# EAGLE design TIA Schematic (EAGLE 6.6.0)
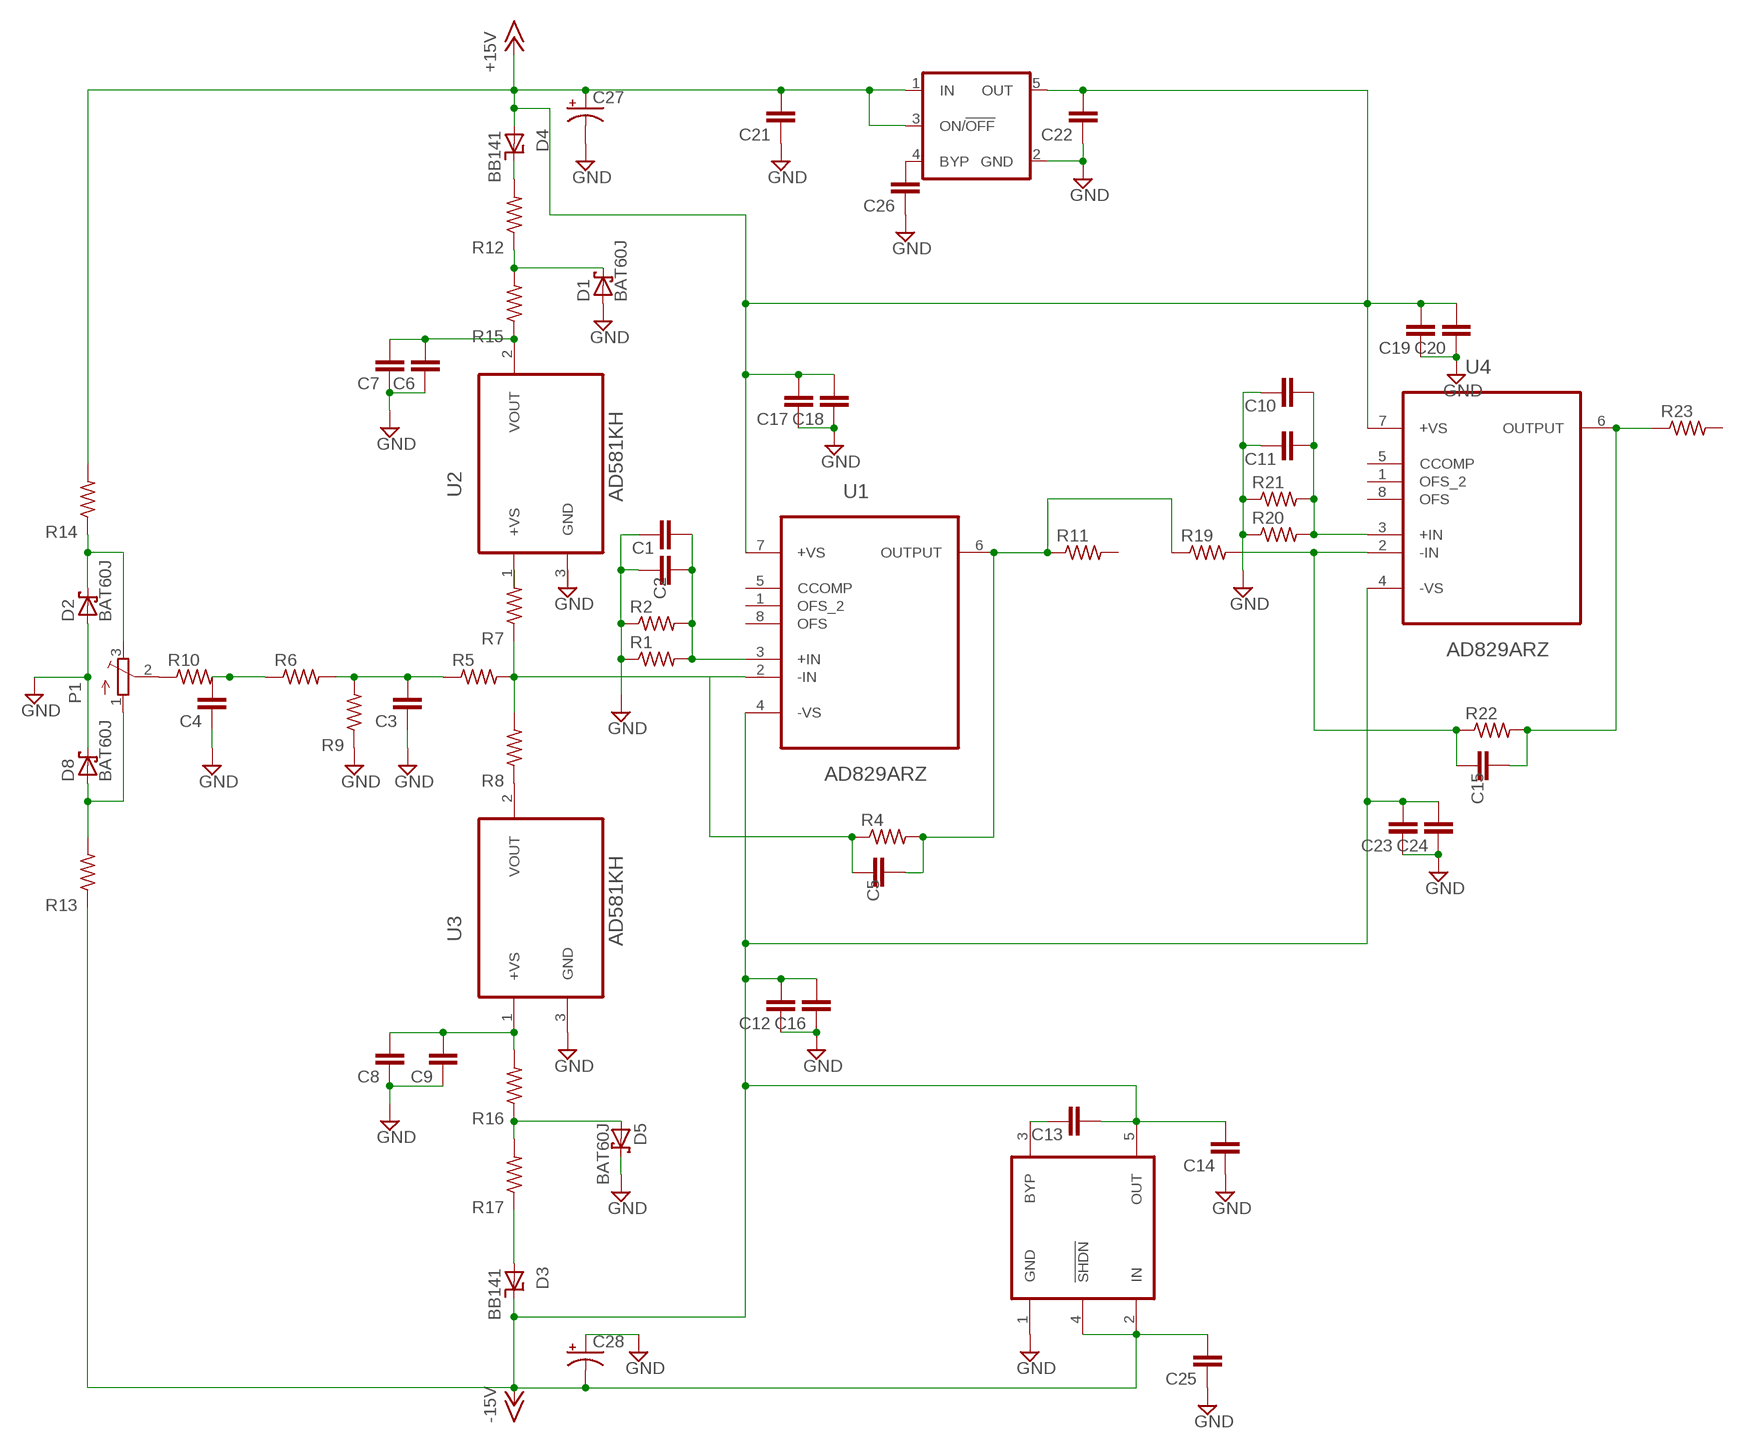
[diagram p0: schematic, sheet 1]

## Parts
C1  C-EUC0603  [C0603]
C2  C-EUC0603  [C0603]
C3  C-EUC0603  [C0603]
C4  C-EUC0603  [C0603]
C5  C-EUC0603  [C0603]
C6  C-EUC0603  [C0603]
C7  C-EUC0603  [C0603]
C8  C-EUC0603  [C0603]
C9  C-EUC0603  [C0603]
C10  C-EUC0603  [C0603]
C11  C-EUC0603  [C0603]
C12  C-EUC0603  [C0603]
C13  C-EUC0603  [C0603]
C14  C-EUC0603  [C0603]
C15  C-EUC0603  [C0603]
C16  C-EUC0603  [C0603]
C17  C-EUC0603  [C0603]
C18  C-EUC0603  [C0603]
C19  C-EUC0603  [C0603]
C20  C-EUC0603  [C0603]
C21  C-EUC0603  [C0603]
C22  C-EUC0603  [C0603]
C23  C-EUC0603  [C0603]
C24  C-EUC0603  [C0603]
C25  C-EUC0603  [C0603]
C26  C-EUC0603  [C0603]
C27  CPOL-USETR3  [ETR3]
C28  CPOL-USETR3  [ETR3]
D1  BAT60J  [SOD323_ST]
D2  BAT60J  [SOD323_ST]
D3  BB141  [SOD523]
D4  BB141  [SOD523]
D5  BAT60J  [SOD323_ST]
D8  BAT60J  [SOD323_ST]
P1  TRIM_EU-3223G  [3223G]
R1  R-US_R0603  [R0603]
R2  R-US_R0603  [R0603]
R4  R-US_R0603  [R0603]
R5  R-US_R0603  [R0603]
R6  R-US_R0603  [R0603]
R7  R-US_R0603  [R0603]
R8  R-US_R0603  [R0603]
R9  R-US_R0603  [R0603]
R10  R-US_R0603  [R0603]
R11  R-US_R0603  [R0603]
R12  R-US_R0603  [R0603]
R13  R-US_R0603  [R0603]
R14  R-US_R0603  [R0603]
R15  R-US_R0603  [R0603]
R16  R-US_R0603  [R0603]
R17  R-US_R0603  [R0603]
R19  R-US_R0603  [R0603]
R20  R-US_R0603  [R0603]
R21  R-US_R0603  [R0603]
R22  R-US_R0603  [R0603]
R23  R-US_R0603  [R0603]
U1  AD829ARZ  [SOIC127P600X175-8N]
U2  AD581KH  [TO254P939X470-3P]
U3  AD581KH  [TO254P939X470-3P]
U4  AD829ARZ  [SOIC127P600X175-8N]
U7  LP2992M5  [SOT23-5]
U8  LT1964  [SOT23-5]

## Nets
+15V: C17.2 C18.2 C19.2 C20.2 C21.2 C22.2 C27.+ D4.A R14.2 U1.7(+VS) U4.7(+VS) U7.1(IN) U7.3(ON/!OFF!) U7.5(OUT)
-15V: C12.2 C13.2 C14.2 C16.2 C23.2 C24.2 C25.2 C28.- D3.C R13.1 U1.4(-VS) U4.4(-VS) U8.2(IN) U8.4(!SHDN!) U8.5(OUT)
GND: C1.1 C2.1 C3.1 C4.1 C6.1 C7.1 C8.1 C9.1 C10.1 C11.1 C12.1 C14.1 C16.1 C17.1 C18.1 C19.1 C20.1 C21.1 C22.1 C23.1 C24.1 C25.1 C26.1 C27.- C28.+ D1.A D2.A D5.C D8.C R1.1 R2.1 R9.1 R20.1 R21.1 U2.3(GND) U3.3(GND) U7.2(GND) U8.1(GND)
N$1: D4.C R12.2
N$2: P1.2(S) R10.1
N$3: C3.2 R5.1 R6.2 R9.2
N$4: C4.2 R6.1 R10.2
N$5: C1.2 C2.2 R1.2 R2.2 U1.3(+IN)
N$6: C5.2 R4.2 R11.1 R19.1 U1.6(OUTPUT)
N$7: C5.1 R4.1 R5.2 R7.1 R8.2 U1.2(-IN)
N$8: D1.C R12.1 R15.2
N$9: R7.2 U2.1(+VS)
N$10: R8.1 U3.2(VOUT)
N$11: C8.2 C9.2 R16.2 U3.1(+VS)
N$12: D5.A R16.1 R17.2
N$13: D3.A R17.1
N$14: D2.C P1.3(E) R14.1
N$15: D8.A P1.1(A) R13.2
N$17: C6.2 C7.2 R15.1 U2.2(VOUT)
N$22: C15.1 R19.2 R22.1 U4.2(-IN)
N$23: C10.2 C11.2 R20.2 R21.2 U4.3(+IN)
N$24: C26.2 U7.4(BYP)
N$25: C13.1 U8.3(BYP)
N$26: C15.2 R22.2 R23.1 U4.6(OUTPUT)
Unconnected: R11.2 R23.2 U1.1(OFS_2) U1.5(CCOMP) U1.8(OFS) U4.1(OFS_2) U4.5(CCOMP) U4.8(OFS)

## Library data of the parts
C1-C26 = rcl:C-EU: CAPACITOR, European symbol
C27 C28 = rcl:CPOL-US: POLARIZED CAPACITOR, American symbol
D1 D2 D5 D8 = diode:BAT60J: Schottky barrier diode Source: www.st.com, BAT60J.pdf
D3 D4 = mylibrary:BB141: Diode SOD-523
P1 = pot:TRIM_EU-: POTENTIOMETER
R1 R2 R4-R17 R19-R23 = rcl:R-US_: RESISTOR, American symbol
U1 U4 = Analog Devices_By_element14_Batch_1:AD829ARZ: High Speed, Low Noise Video Op Amp; MPN: AD829ARZ; OC_FARNELL: 1651322; OC_NEWARK: 82H3000; PACKAGE: SOIC-8; SUPPLIER: Analog Devices
U2 U3 = Analog Devices_By_element14_Batch_1:AD581KH: High Precision 10 V IC Reference; MPN: AD581KH; OC_FARNELL: 4414640; OC_NEWARK: 05F7034; PACKAGE: TO-5-3; SUPPLIER: Analog Devices
U7 = LP2992M5:LP2992M5
U8 = LT1964:LT1964

## Board
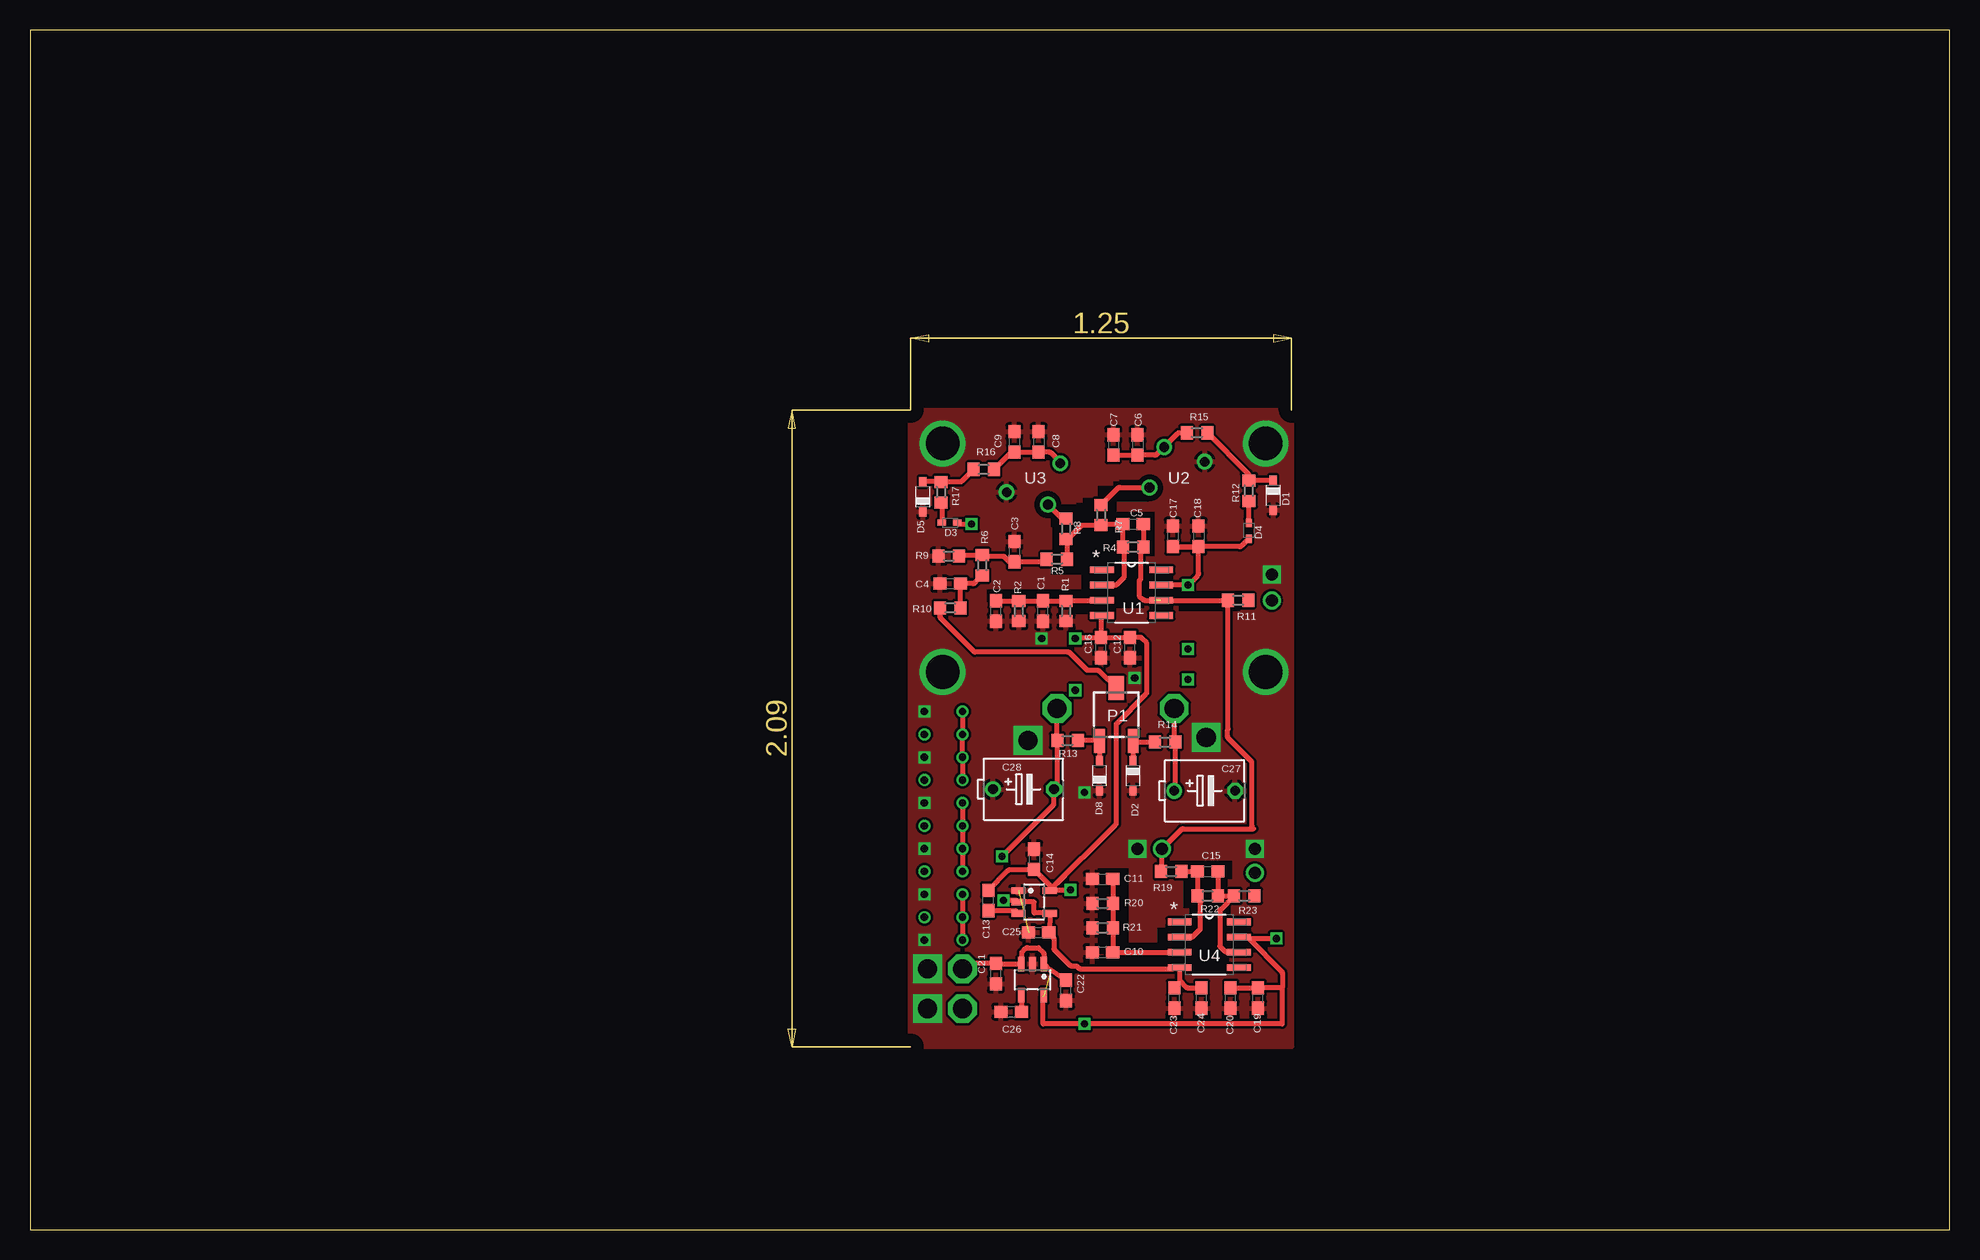
[diagram p1: board, top side]
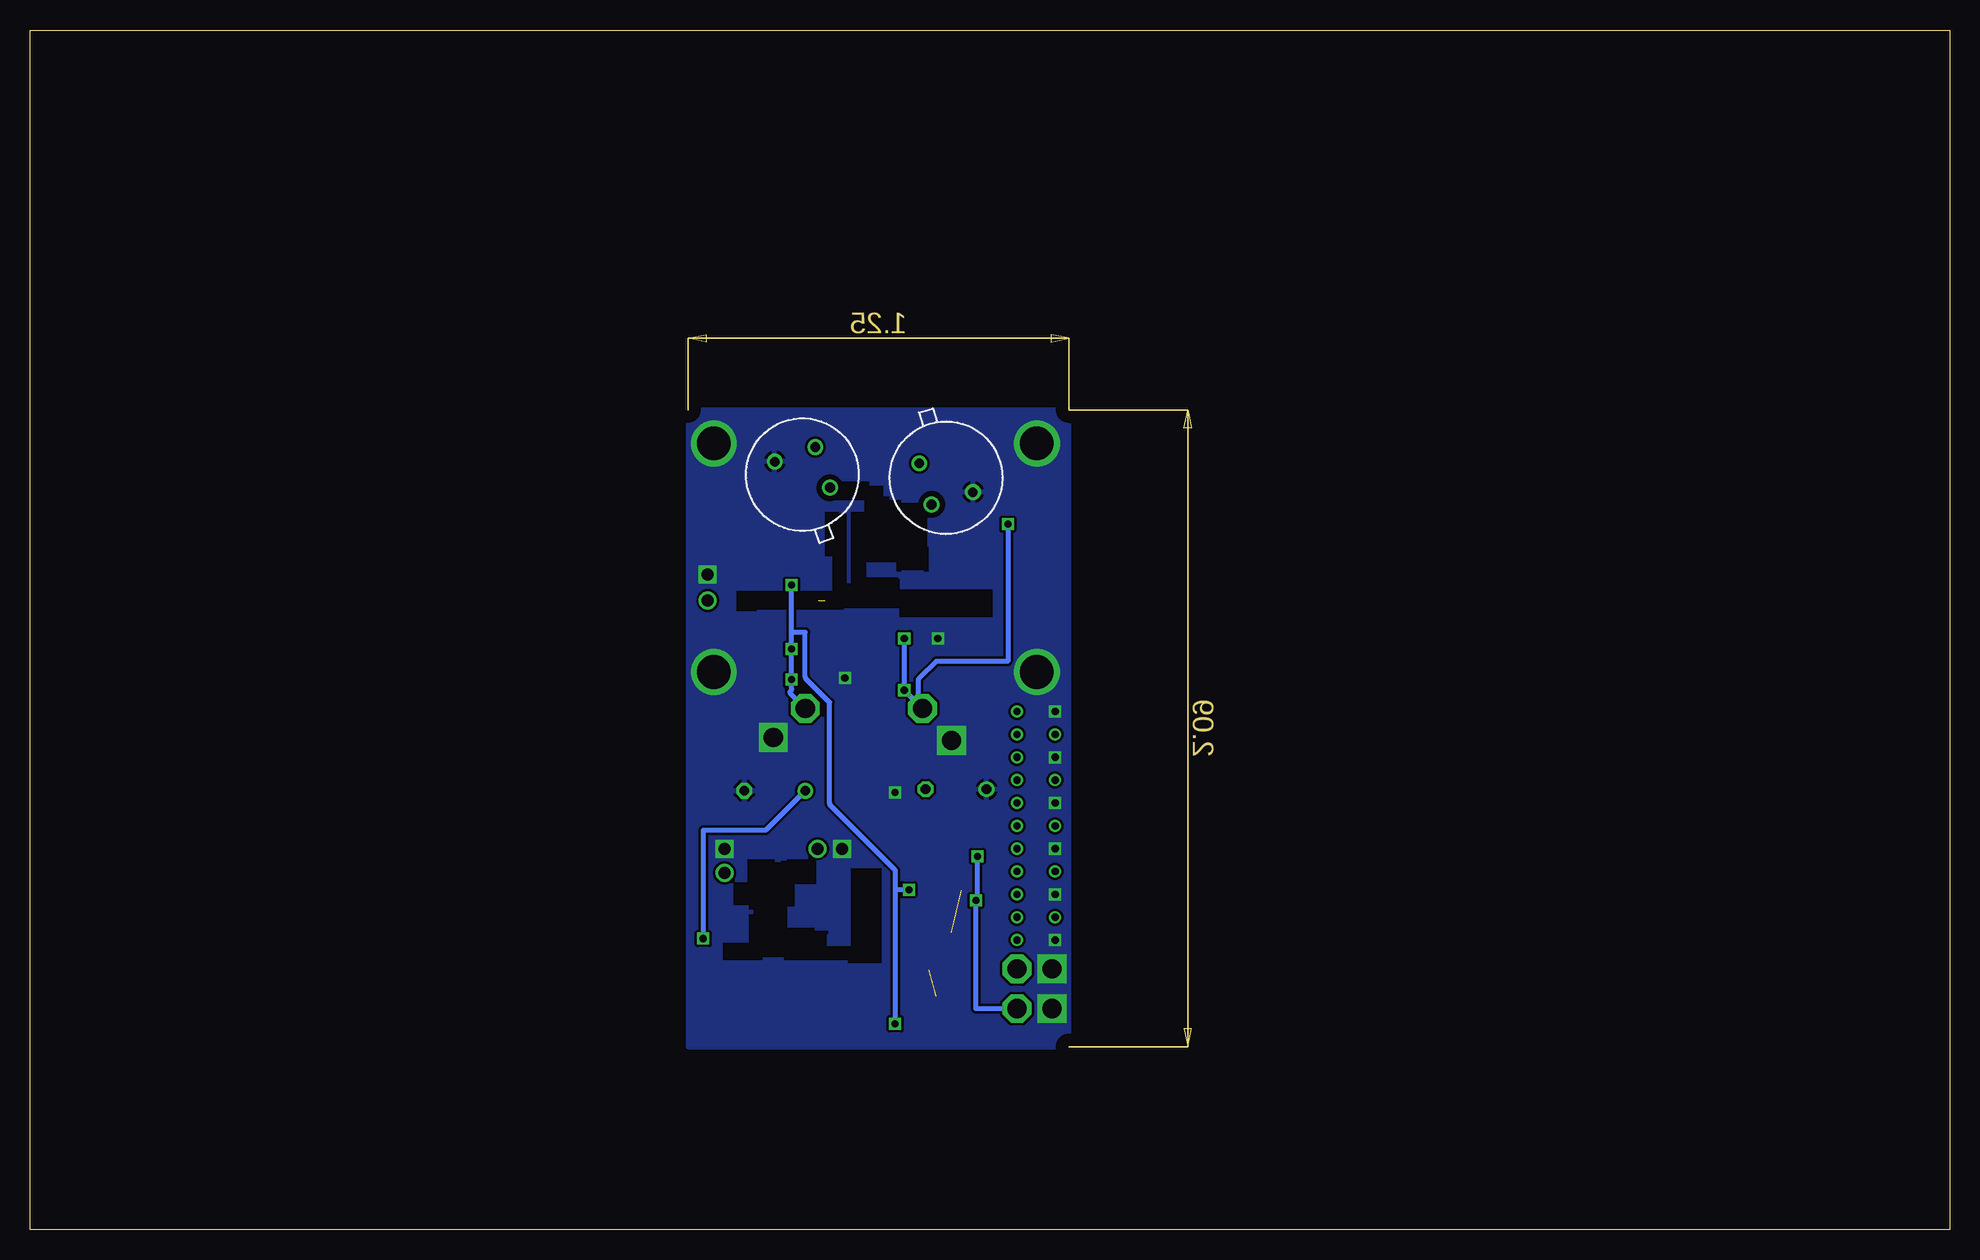
[diagram p2: board, bottom side, seen from below]

Size 160 x 100 mm. Coordinates in mm from the lower left corner, seen from the top.
Outline: 0,0 160,0 160,100 0,100 0,0
Copper layers (1*16): Top 0.035mm / dielectric 1.5mm / Bottom 0.035mm
Design rules "default": minimum track width 10mil, minimum drill 24mil, track to track 8mil, track to pad 8mil, pad to pad 8mil, via to via 8mil, smd to smd 8mil, copper to edge 40mil, drill to drill 8mil, minimum pad ring 10mil, minimum via ring 8mil, stop-mask expansion 4mil, vias tented up to drill 0mil, thermal gap 10mil
tRestrict: area 95.8,51.6 to 100.8,53.2; area 86.1,55 to 87.8,57.4; area 87.2,55.9 to 90.9,58.2; area 85.1,58.5 to 87.6,60.5; area 89,61 to 90.8,62; area 90.8,61.6 to 93,62.5; area 90.3,61.7 to 91.2,62.4; area 89.5,60.7 to 93.2,61.6; area 96.5,21.3 to 99.9,24.1; area 85.2,56.9 to 85.9,58.7; area 87.2,59.1 to 88,60.6; area 87.6,52.8 to 90.9,55.9; 22 more areas
bRestrict: area 83.9,59.6 to 85.7,61.4; area 92.4,61 to 94.2,62.7; area 79.8,51.1 to 87.5,53.3; area 87.4,51.8 to 90.9,53.1; area 87.5,53.2 to 91.1,54.2; area 87.6,54 to 91.1,54.4; area 90.3,53.7 to 91.6,59.8; area 90,60.8 to 93.2,62.4; area 88.9,60.1 to 90.4,62; area 88.4,57.9 to 90.3,61.1; area 86.6,57.9 to 88.4,59.3; area 85.2,56.8 to 87.5,60.1; 39 more areas

### Footprints (pad centres in the part's own frame; a part is rotated, then mirrored left to right if it is on the bottom)
C0603 = smd 1.1 x 1: 1 -0.85,0; 2 0.85,0
ETR3 = drill 0.813: + -2.54,0 | drill 0.813 octagon: - 2.54,0
SOD323_ST = smd 0.8 x 0.6: A 1.25,0; C -1.25,0
SOD523 = smd 0.7 x 0.5: A 0.7,0; C -0.6,0
3223G = smd 2 x 0.9: 1 -2.2,1.4; 3 -2.2,-1.4 | smd 2 x 1.3: 2 2.2,0
R0603 = smd 1 x 1.1: 1 -0.85,0; 2 0.85,0
SOIC127P600X175-8N = smd 1.981 x 0.559: 1 -2.464,1.905; 2 -2.464,0.635; 3 -2.464,-0.635; 4 -2.464,-1.905; 5 2.464,-1.905; 6 2.464,-0.635; 7 2.464,0.635; 8 2.464,1.905
TO254P939X470-3P = drill 0.813: 1 -5.08,0; 2 -2.54,-2.54; 3 0,0
SOT23-5 = smd 0.55 x 1.2: 1 -0.95,-1.3; 2 0,-1.3; 3 0.95,-1.3; 4 0.95,1.3; 5 -0.95,1.3

### Placement (x,y rotation side)
C1  84.45,51.56 90 top
C2  80.52,51.56 90 top
C3  82.04,56.52 270 top
C4  76.71,53.85 0 top
C5  91.95,58.8 0 top
C6  92.33,65.41 270 top
C7  90.3,65.41 270 top
C8  84.07,65.66 270 top
C9  82.04,65.66 270 top
C10  89.41,23.11 0 top
C11  89.41,29.21 0 top
C12  91.69,48.51 90 top
C13  79.88,27.43 90 top
C14  83.69,30.86 270 top
C15  98.17,29.84 0 top
C16  89.28,48.51 90 top
C17  95.25,57.78 270 top
C18  97.41,57.78 270 top
C19  102.36,19.3 90 top
C20  100.08,19.3 90 top
C21  80.52,21.34 90 top
C22  86.36,19.94 90 top
C23  95.38,19.3 90 top
C24  97.66,19.3 90 top
C25  84.07,24.77 0 top
C26  81.79,18.16 0 top
C27  97.92,36.58 0 top
C28  82.8,36.7 0 top
D1  103.63,61.21 270 top
D2  91.95,37.85 270 top
D3  76.71,58.93 180 top
D4  101.6,58.29 270 top
D5  74.42,61.09 90 top
D8  89.15,37.85 90 top
P1  90.55,42.93 90 top
R1  86.36,51.56 90 top
R2  82.42,51.56 90 top
R4  91.95,56.9 0 top
R5  85.6,55.88 0 top
R6  79.38,55.37 90 top
R7  89.28,59.56 90 top
R8  86.36,58.42 270 top
R9  76.58,56.13 0 top
R10  76.71,51.82 0 top
R11  100.71,52.45 0 top
R12  101.6,61.59 270 top
R13  86.49,40.77 0 top
R14  94.61,40.64 0 top
R15  97.28,66.42 0 top
R16  79.5,63.37 0 top
R17  75.95,61.47 90 top
R19  95.12,29.84 0 top
R20  89.41,27.18 0 top
R21  89.41,25.15 0 top
R22  98.17,27.81 0 top
R23  101.22,27.81 0 top
U1  91.82,53.09 0 top
U2  97.92,64.01 155 bottom
U3  81.41,61.47 331.7 bottom
U4  98.3,23.75 0 top
U7  83.57,20.83 180 top
U8  83.69,27.3 270 top

### Tracks (layer width: path | path; a pad name or v marks a point on that pad's centre or on a via)
+15V  (via drill 0.6, 1.6)  (2 unrouted)
  Top 0.406: C18.2 C17.2 arc45 95.34,56.9 97.41,56.9 | C20.2 C19.2 104.3,20.15 arc45 104.39,20.19 | C27.+ 95.39,36.59 arc45 95.47,36.77 R14.2 95.45,40.65 arc-45 95.38,40.83 v95.38,43.43 | C18.2 97.41,54.72 arc-45 97.33,54.54 v96.52,53.72 U1.7 | D4.A 101.02,57.01 arc-45 100.84,56.94 C18.2 | 104.39,20.19 104.39,17.14 84.45,17.14 84.45,19.43 | C22.2 85.12,21.63 arc-45 84.94,21.7 U7.1 84.52,22.95 arc45 84.44,23.13 84.07,23.5 83.16,23.5 arc45 82.98,23.42 82.68,23.11 82.68,22.27 arc-45 U7.3 80.66,22.13 arc-45 C21.2 77.72,22.19 v77.72,21.72 | 101.6,24.26 v103.89,24.26 | 101.6,24.26 104.32,21.54 arc-45 104.39,21.36 104.39,20.19 | 101.6,24.26 101.55,24.31 arc45 101.37,24.38 U4.7
  Bottom 0.406: v95.38,43.43 96.57,44.63 arc45 96.65,44.81 96.59,44.86 arc-45 96.52,45.04 v96.52,45.85 v96.52,48.39 96.52,49.78 | 96.52,49.78 v96.52,53.72 | C27.+ 98.61,33.35 arc45 98.78,33.27 103.89,33.27 v103.89,24.26 | 96.52,49.78 95.38,49.78 95.38,46.08 arc-45 95.3,45.9 93.34,43.94 93.34,35.54 arc-45 93.27,35.36 87.88,29.97 v87.88,17.14
-15V  (via drill 0.6, 1.6)
  Top 0.406: U1.4 U1.4 arc45 89.28,51 C16.2 | C16.2 C12.2 92.52,49.36 arc-45 92.7,49.29 93.09,48.9 93.09,44.81 arc-45 93.02,44.63 90.55,42.16 90.55,33.92 arc-45 90.48,33.74 U8.5 | C16.2 89.3,49.35 arc45 89.47,49.28 | C23.2 95.76,20.54 arc45 95.83,20.72 | 95.83,20.72 U4.4 95.48,21.84 arc45 95.3,21.77 95.25,21.72 87.61,21.72 arc-45 87.43,21.79 87.25,21.97 86.85,21.97 arc-45 86.67,22.05 85.34,23.37 85.34,24.24 arc45 85.27,24.42 C25.2 85.05,26.38 | 95.83,20.72 96.32,20.23 arc45 96.5,20.15 C24.2 | D3.C 77.36,58.88 arc45 77.54,58.8 v78.49,58.8 | v85.6,43.43 85.6,40.86 arc45 R13.1 85.64,37.1 arc-45 85.56,36.92 C28.- 85.34,35.54 arc-45 85.27,35.36 v81.03,31.11 | v87.12,49.28 87.14,49.29 arc-45 87.31,49.36 C16.2 | U8.4 arc-45 85.05,26.38 | U8.5 84.99,28.61 arc45 84.92,28.79 C14.2 81.72,30.01 arc45 81.54,29.94 C13.2 | v81.15,27.43 82.16,27.43 arc-45 82.34,27.36 U8.2 83.69,27.3 83.69,26.38 85.05,26.38 | U8.5 86.18,29.44 arc-45 86.23,29.46 | U8.5 arc-45 85.15,28.32 v86.74,28.32
  Bottom 0.406: v85.6,43.43 85.98,43.81 | 85.98,43.81 87.05,44.88 arc45 87.12,45.06 v87.12,49.28 | v78.49,58.8 78.49,47.37 84.45,47.37 85.91,45.92 arc-45 85.98,45.74 85.98,43.81 | v81.03,31.11 81.03,27.66 arc45 81.1,27.48 v81.15,27.43 81.15,18.41 v77.72,18.41 | v86.74,28.32 87.63,28.32
GND  (via drill 0.6, 1, 1.6, 2.8 pad 1.68)  (1 unrouted)
  other vias: 103,46.48 76.07,46.48 76.07,65.53 103,65.53 103.5,54.61 102.11,31.75 83.19,40.77 98.04,41.02 92.33,31.75 84.33,49.28 92.08,45.97 87.88,36.45 74.55,43.18 74.55,39.37 74.55,35.56 74.55,31.75 74.55,27.94 74.8,18.41 74.8,21.72 74.55,24.13
  pour Bottom: 73.41,68.33 105.16,68.33 105.16,15.24 73.41,15.24
  pour Top: 73.41,68.33 105.16,68.33 105.16,15.24 73.41,15.24
N$1
  Top 0.406: D4.C R12.2
N$2
  Top 0.406: P1.2 89.14,46.53 arc45 88.96,46.61 88.14,46.61 86.69,48.06 arc45 86.51,48.13 78.74,48.13 75.93,50.94 arc-45 75.86,51.12 R10.1
N$3
  Top 0.406: R5.1 84.61,55.74 arc-45 84.43,55.66 C3.2 81.73,55.66 arc-45 81.55,55.74 81.15,56.13 79.57,56.13 arc-45 79.39,56.21 R6.2 77.62,56.22 arc45 77.44,56.15 R9.2
N$4
  Top 0.406: R6.1 78.78,53.92 arc-45 78.6,53.85 C4.2 R10.2
N$5
  Top 0.406: C2.2 R2.2 C1.2 R1.2 arc-45 86.45,52.45 U1.3
N$6  (via drill 1)  (1 unrouted)
  Top 0.406: C5.2 R4.2 92.66,56.76 arc45 92.58,56.58 92.58,54.23 92.53,54.18 arc45 92.46,54 92.46,52.83 92.76,52.52 arc45 92.94,52.45 93.73,52.45 | U1.6 R11.1 99.86,41.75 arc-45 99.82,41.66 99.82,41.13 arc45 99.9,40.95 101.85,38.99 101.85,33.63 arc45 101.93,33.45 101.98,33.4 96.12,33.4 arc45 95.94,33.33 v94.36,31.75 94.36,30.04 arc-45 94.29,29.86 R19.1
N$7
  Top 0.406: U1.2 90.45,53.72 arc45 90.62,53.8 91.19,54.36 91.19,56.7 arc45 91.11,56.88 R4.1 C5.1 89.47,58.8 arc45 89.3,58.73 R7.1 87.77,58.71 arc45 87.59,58.64 86.49,57.53 86.45,57.53 | R8.2 arc45 86.45,57.53 | 86.45,57.53 arc45 86.45,57.52 R5.2
N$8
  Top 0.406: R15.2 101.53,63.03 arc-45 101.6,62.85 R12.1 103.59,62.45 arc45 D1.C
N$9
  Top 0.406: R7.2 90.66,61.79 arc-45 90.83,61.86 U2.1
N$10
  Top 0.406: U3.2 85.94,59.34 arc45 86.12,59.27 R8.1
N$11
  Top 0.406: U3.1 arc-45 85.85,63.94 85.85,64.01 85.12,64.73 arc45 84.95,64.81 C8.2 C9.2 81.89,64.81 arc45 81.71,64.73 R16.2
N$12
  Top 0.406: R16.1 77.67,62.39 arc-45 77.49,62.32 R17.2 arc45 75.9,62.34 D5.A
N$13
  Top 0.406: R17.1 arc-45 76.01,60.47 D3.A
N$14
  Top 0.406: D2.C P1.3 arc-45 P1.3 91.96,40.71 arc45 92.14,40.64 R14.1
N$15
  Top 0.406: R13.2 89.05,40.77 arc-45 P1.1 arc-45 P1.1 D8.A
N$16  (via drill 1)
  other vias: 103.5,52.45
N$17
  Top 0.406: R15.1 95.83,66.42 arc45 95.65,66.35 U2.2 93.93,64.63 arc-45 93.75,64.56 C6.2 C7.2
N$22
  Top 0.406: R19.2 C15.1 R22.1 97.46,27.67 arc-45 97.54,27.49 97.54,25.02 96.97,24.46 arc-45 96.8,24.38 U4.2
N$23
  Top 0.406: C11.2 R20.2 R21.2 C10.2 U4.3
N$24
  Top 0.406: U7.4 arc-45 82.64,19.48 C26.2
N$25
  Top 0.406: U8.3 82.24,26.51 arc45 82.06,26.58 C13.1
N$26
  Top 0.406: C15.2 R22.2 R23.1 99.26,26.7 arc45 99.19,26.53 99.19,23.62 99.62,23.19 arc45 99.8,23.11 U4.6
N$31  (via drill 0.6)
  other vias: 74.55,26.04
N$33  (via drill 0.6)
  Top 0.406: v77.72,27.94 v77.72,26.04 v77.72,24.13
N$35  (via drill 1)
  other vias: 102.11,29.72
N$36  (via drill 0.6)
  other vias: 74.55,29.84
N$40  (via drill 0.6)
  other vias: 74.55,33.66
N$43  (via drill 0.6)
  other vias: 87.12,44.96
N$44  (via drill 0.6)
  other vias: 74.55,37.47
N$45  (via drill 0.6)
  other vias: 74.55,41.27
N$47  (via drill 0.6)
  Top 0.406: v77.72,43.18 v77.72,41.27 v77.72,39.37 v77.72,37.47
N$50  (via drill 0.6)
  Top 0.406: v77.72,35.56 v77.72,33.66 v77.72,31.75 v77.72,29.84